# Altium schematic sheet Sensor Package.SchDoc
size A
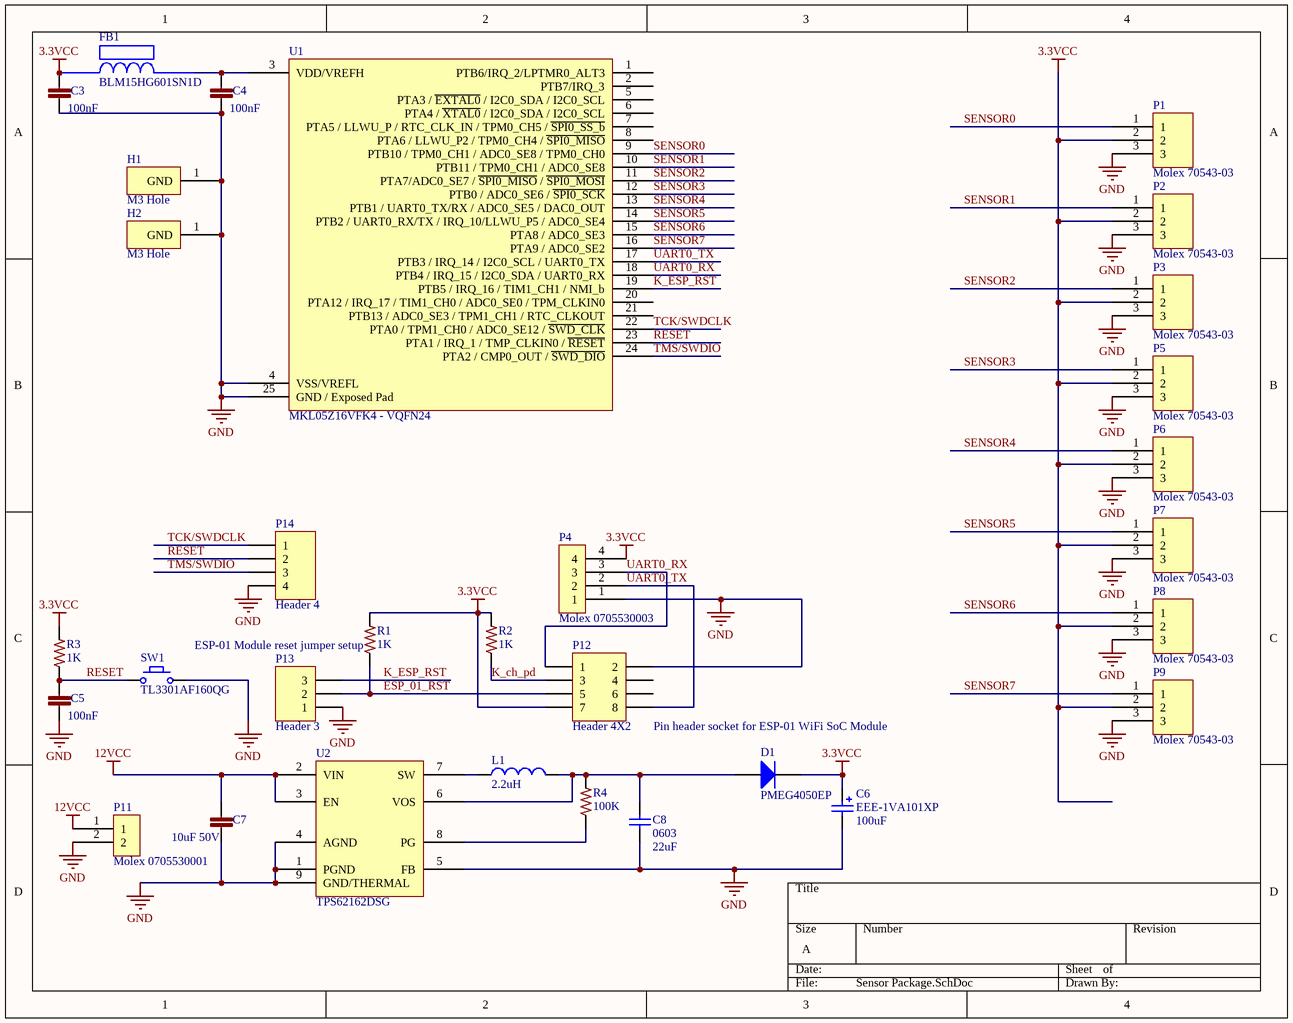
[diagram p0: Sensor Package.SchDoc]

## Parts
C3  100nF  [C0402]
C4  100nF  [C0402]
C5  100nF  [C0402]
C6  EEE-1VA101XP  value 100uF  [EEE-1VA101XP]
C7  10uF 50V  [C1206]
C8  0603  value 22uF  [C0805]
D1  PMEG4050EP  [PMEG4050EP]
FB1  BLM15HG601SN1D  [BLM18PG121SN1D]
H1  M3 Hole  [Hole-3mm]
H2  M3 Hole  [Hole-3mm]
L1  value 2.2uH  [VLS252012T-2R2M1R3]  (hidden comment: VLS252012T-2R2M1R3)
P1  Molex 70543-03  [70543-03]
P2  Molex 70543-03  [70543-03]
P3  Molex 70543-03  [70543-03]
P4  Molex 0705530003  [0705530003]
P5  Molex 70543-03  [70543-03]
P6  Molex 70543-03  [70543-03]
P7  Molex 70543-03  [70543-03]
P8  Molex 70543-03  [70543-03]
P9  Molex 70543-03  [70543-03]
P11  Molex 0705530001  [0705530001]
P12  Header 4X2  [HDR2X4]
P13  Header 3  [HDR1X3]
P14  Header 4  [HDR1X4]
R1  1K  [R0603]
R2  1K  [R0603]
R3  1K  [R0603]
R4  100K  [R0603]
SW1  TL3301AF160QG  [TL3301AF160QG]
U1  MKL05Z16VFK4 - VQFN24  [98ASA00474D]
U2  TPS62162DSG  [DSG8-1600X900TP]

## Nets
3.3VCC: C3.1 C6.1 D1.1(A) FB1.1 P1.2 P2.2 P3.2 P4.4 P5.2 P6.2 P7.2 P8.2 P9.2 P12.7 R1.2 R2.2 R3.2
12VCC: C7.1 P11.1 U2.2(VIN) U2.3(EN)
GND: C3.2 C4.2 C5.2 C6.2 C7.2 C8.1 H1.1(GND) H2.1(GND) P1.3 P2.3 P3.3 P4.1 P5.3 P6.3 P7.3 P8.3 P9.3 P11.2 P12.2 P13.1 P14.4 SW1.2 U1.4(VSS/VREFL) U1.25(GND_/_Exposed_Pad) U2.1(PGND) U2.4(AGND) U2.5(FB) U2.9(GND/THERMAL)
ESP_01_RST: P12.5 P13.2 R1.1
K_ch_pd: P12.3 R2.1
K_ESP_RST: P13.3 U1.19(PTB5_/_IRQ_16_/_TIM1_CH1_/_NMI_b)
RESET: C5.1 P14.2 R3.1 SW1.1 U1.23(PTA1_/_IRQ_1_/_TMP_CLKIN0_/_~{RESET})
SENSOR0: P1.1 U1.9(PTB10_/_TPM0_CH1_/_ADC0_SE8_/_TPM0_CH0)
SENSOR1: P2.1 U1.10(PTB11_/_TPM0_CH1_/_ADC0_SE8)
SENSOR2: P3.1 U1.11(PTA7/ADC0_SE7_/_~{SPI0_MISO}_/_~{SPI0_MOSI})
SENSOR3: P5.1 U1.12(PTB0_/_ADC0_SE6_/_~{SPI0_SCK})
SENSOR4: P6.1 U1.13(PTB1_/_UART0_TX/RX_/_ADC0_SE5_/_DAC0_OUT)
SENSOR5: P7.1 U1.14(PTB2_/_UART0_RX/TX_/_IRQ_10/LLWU_P5_/_ADC0_SE4)
SENSOR6: P8.1 U1.15(PTA8_/_ADC0_SE3)
SENSOR7: P9.1 U1.16(PTA9_/_ADC0_SE2)
TCK/SWDCLK: P14.1 U1.22(PTA0_/_TPM1_CH0_/_ADC0_SE12_/_~{SWD_CLK})
TMS/SWDIO: P14.3 U1.24(PTA2_/_CMP0_OUT_/_~{SWD_DIO})
UART0_RX: P4.3 P12.1 U1.18(PTB4_/_IRQ_15_/_I2C0_SDA_/_UART0_RX)
UART0_TX: P4.2 P12.8 U1.17(PTB3_/_IRQ_14_/_I2C0_SCL_/_UART0_TX)
NetC4_1: C4.1 FB1.2 U1.3(VDD/VREFH)
NetC8_2: C8.2 D1.2(K) L1.2 R4.2 U2.6(VOS)
NetL1_1: L1.1 U2.7(SW)
NetR4_1: R4.1 U2.8(PG)

Not connected (* = marked no-connect by the designer): P12 4 6; U1 1(PTB6/IRQ_2/LPTMR0_ALT3) 2(PTB7/IRQ_3) 5(PTA3_/_~{EXTAL0}_/_I2C0_SDA_/_I2C0_SCL) 6(PTA4_/_~{XTAL0}_/_I2C0_SDA_/_I2C0_SCL) 7(PTA5_/_LLWU_P_/_RTC_CLK_IN_/_TPM0_CH5_/_~{SPI0_SS_b}) 8(PTA6_/_LLWU_P2_/_TPM0_CH4_/_~{SPI0_MISO}) 20(PTA12_/_IRQ_17_/_TIM1_CH0_/_ADC0_SE0_/_TPM_CLKIN0) 21(PTB13_/_ADC0_SE3_/_TPM1_CH1_/_RTC_CLKOUT)

## Notes on the sheet
- (near R1) ESP-01 Module reset jumper setup
- Pin header socket for ESP-01 WiFi SoC Module

## Library data of the parts
C3-C5 = GRM155R71C104KA88D: CAP CER 0402 100nF 16V 10% X7R; LastRevisionNote: ImportComponents; Published: 23-Apr-2014; Publisher: UltiMachine; LastRevisionDate: 23-Apr-2014; ManufacturerPartNumber: GRM155R71C104KA88D; VALUE: 100nF
C6 = EEE-1VA101XP: CAP ALUM 100UF 35V 20% SMD; Manufacture: Panasonic; Digikey Part #: PCE3951CT-ND; Price: $0.63; Mount Type: SMT Panasonic VS D Series; Status: Active; Height: 7.70mm; Datasheet: http://industrial.panasonic.com/www-cgi/jvcr13pz.cgi?E+PZ+3+ABA0002+EEE1VA101XP+7+WW; Manufacture Part #: EEE-1VA101XP
C7 = CL31A106KBHNNNE: CAP CER 10UF 50V 10% X5R 1206; Manufacturer: Samsung; LastRevisionNote: ImportComponents; Published: 25-mar-2015; Publisher: UltiMachine; LastRevisionDate: 25-mar-2015; ManufacturerPartNumber: CL31A106KBHNNNE; VALUE: 10uF 50V
C8 = CL21A226KQQNNNE: CAP CER 22UF 6.3V 10% X5R 0805; MFR: Samsung; Voltage: 6.3VDC; Published: April 2015; LatestRevisionDate: April 2015; Component Type: Chip Capacitor; MFR Part #: CL21A226KQQNNNE; Part Description: CAP CER 22UF 6.3V 10% X5R 0805; Mounting Type: SMT 0805; Datasheet: http://www.digikey.com/product-detail/en/CL21A226KQQNNNE/1276-2907-2-ND/3888565; Height: 1mm; Tolerance: 10%; Digikey #: 1276-2907-2-ND; PackageReference: 0805
D1 = PMEG4050EP: PMEG4050EP , Schottky Diode; Published: 8-Jun-2000; LatestRevisionDate: 17-Jul-2002; LatestRevisionNote: Re-released for DXP Platform.; PackageVersion: Sep-1996; PackageReference: SMC; Publisher: Altium Limited; PackageDescription: DO-214-AB/SMC; 2 C-Bend Leads; Body 7.9 x 5.9 mm, inc. leads (LxW); Code_JEDEC: DO-214-AB
H1 H2 = Hole: 3mm Hole
L1 = VLS252012T-2R2M1R3: MFR: TDK Corporation; Published: April 2015; LatestRevisionDate: April 2015; LatestRevisionNote: IPC-7351 Footprint Added.; PackageReference: Custom Wound INductor; Publisher: Adam Vadala-Roth; PackageDescription: Wire Wound Inductor Package; MFR#: VLS252012T-2R2M1R3
P1-P3 P5-P9 = Molex Endstop
P4 = 0705530003: Molex 0705530003 Right Angle 2.54mm Shrouded Header; MFR: Molex; MFR#: 0705530003; Type: 2.54mm shrouded 4 pin right angle throughhole connector; Digikey #: WM4902-ND
P11 = 0705530001: Molex 0705530002 Right Angle 2.54mm Shrouded Header; MFR: Molex; MFR#: 0705530001; Type: 2.54mm shrouded 2 pin right angle throughhole connector; Digikey #: WM4900-ND
P12 = Header 4X2: Header, 4-Pin, Dual row; LatestRevisionDate: 17-Jul-2002; LatestRevisionNote: Re-released for DXP Platform.; Publisher: Altium Limited
P13 = Header 3: Header, 3-Pin; LatestRevisionDate: 17-Jul-2002; LatestRevisionNote: Re-released for DXP Platform.; Publisher: Altium Limited
P14 = Header 4: Header, 4-Pin; LatestRevisionDate: 17-Jul-2002; LatestRevisionNote: Re-released for DXP Platform.; Publisher: Altium Limited
R1-R3 = ERJ-3EKF1001V: RES 0603 1K 100mW 1%; LastRevisionNote: ImportComponents; Published: 23-Apr-2014; Publisher: UltiMachine; LastRevisionDate: 23-Apr-2014; ManufacturerPartNumber: ERJ-3EKF1001V; VALUE: 1K
R4 = RC0603FR-07100KL: RES 100K OHM 1/10W 1% 0603 SMD; LastRevisionNote: ImportComponents; Published: 23-Apr-2014; Publisher: UltiMachine; LastRevisionDate: 23-Apr-2014; ManufacturerPartNumber: RC0603FR-07100KL; VALUE: 100K
U1 = MKL05Z16VFK4 - 24 Pin VQFN: ARM Cortex M0+
U2 = TPS62162SOP
SW1 = TL3301AF160QG: MFR: *; MFR#: TL3301AF160QG; Type: SMD Momentary Tactile Switch; Height: *